# Altium project BiDirectional Charger - DC-DC.PrjPcb
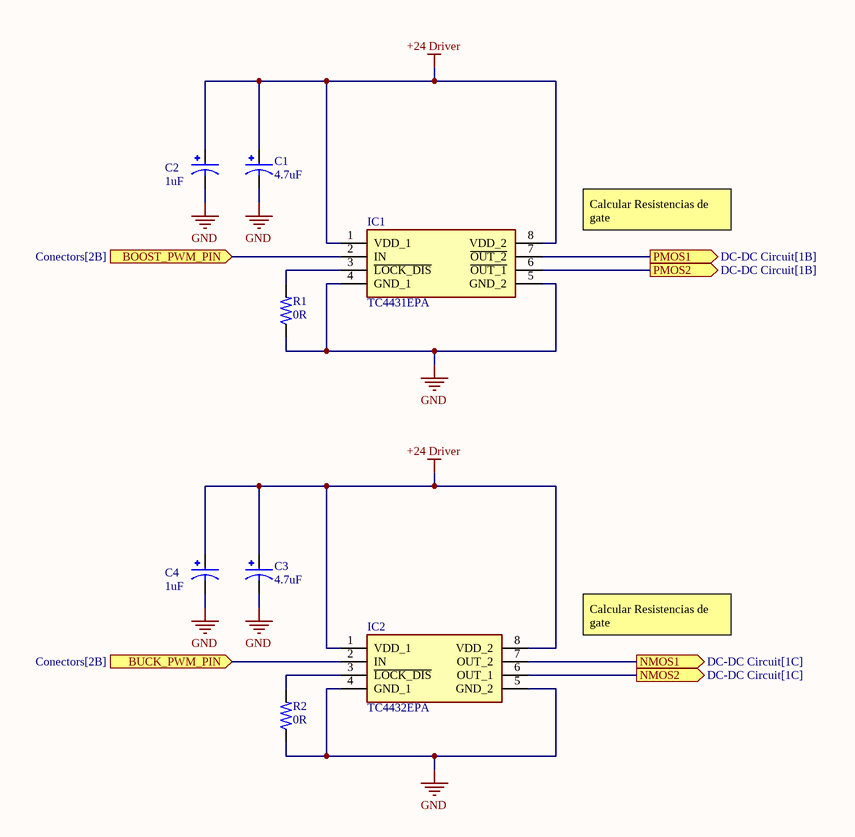
[diagram p0: Mosfet Driver.SchDoc]
3 sheets, 57 parts. Net scope: flat (ports and power ports of the same name join across sheets).
Board file: DC-DC PCB.PcbDoc
Sheets:
  Mosfet Driver.SchDoc
  DC-DC Circuit.SchDoc
  Conectors.SchDoc

## Sheet Mosfet Driver.SchDoc
size A4; SheetNumber: 1; SheetTotal: 2

### Parts
C1  4.7uF  [Electrolytic 4x5.4]
C2  1uF  [Electrolytic 4x5.4]
C3  4.7uF  [Electrolytic 4x5.4]
C4  1uF  [Electrolytic 4x5.4]
IC1  TC4431EPA  [DIP781W56P254L950H533Q8N]
IC2  TC4432EPA  [DIP781W56P254L950H533Q8N]
R1  0R  [0805]
R2  0R  [0805]

### Ports
BOOST_PWM_PIN (in, see Conectors[2B]), BUCK_PWM_PIN (in, see Conectors[2B]), NMOS1 (out, see DC-DC Circuit[1C]), NMOS2 (out, see DC-DC Circuit[1C]), PMOS1 (out, see DC-DC Circuit[1B]), PMOS2 (out, see DC-DC Circuit[1B])

### Nets
+24 Driver: C1.1 C2.1 C3.1 C4.1 IC1.1(VDD_1) IC1.8(VDD_2) IC2.1(VDD_1) IC2.8(VDD_2)
GND: C1.2 C2.2 C3.2 C4.2 IC1.4(GND_1) IC1.5(GND_2) IC2.4(GND_1) IC2.5(GND_2) R1.1 R2.1
NetIC1_2: IC1.2(IN) ; port BOOST_PWM_PIN
NetIC1_3: IC1.3(~{LOCK_DIS}) R1.2
NetIC1_6: IC1.6(~{OUT_1}) ; port PMOS2
NetIC1_7: IC1.7(~{OUT_2}) ; port PMOS1
NetIC2_2: IC2.2(IN) ; port BUCK_PWM_PIN
NetIC2_3: IC2.3(~{LOCK_DIS}) R2.2
NetIC2_6: IC2.6(OUT_1) ; port NMOS2
NetIC2_7: IC2.7(OUT_2) ; port NMOS1

### Notes on the sheet
- Calcular Resistencias de gate

### Library data of the parts
C1-C4 = Electrolytic 4x5.4: MF: Panasonic; MP: EEE-HA1E100WR; Package: RADIAL-2 Panasonic; Check_prices: https://www.snapeda.com/parts/EEE-HA1E100WR/Panasonic/view-part/778519/?ref=eda; Value: *; Price: None; Purchase-URL: https://pricing.snapeda.com/search/part/EEE-HA1E100WR/?ref=eda; SnapEDA_Link: https://www.snapeda.com/parts/EEE-HA1E100WR/Panasonic/view-part/778519/?ref=snap; Availability: In Stock
IC1 = TC4431EPA: Integrated Circuit; Manufacturer_Name: Microchip; Datasheet Link: http://www.microchip.com/mymicrochip/filehandler.aspx?ddocname=en011707; Height: 5.334mm; Manufacturer_Part_Number: TC4431EPA; Mouser Part Number: 579-TC4431EPA; Mouser Price/Stock: https://www.mouser.co.uk/ProductDetail/Microchip-Technology/TC4431EPA?qs=6NittM2kKvToa0NDydYeNA%3D%3D; Arrow Part Number: TC4431EPA; Arrow Price/Stock: https://www.arrow.com/en/products/tc4431epa/microchip-technology
IC2 = TC4432EPA: Integrated Circuit; Manufacturer_Name: Microchip; Datasheet Link: http://ww1.microchip.com/downloads/en/DeviceDoc/21424d.pdf; Height: 5.334mm; Manufacturer_Part_Number: TC4432EPA; Mouser Part Number: 579-TC4432EPA; Mouser Price/Stock: https://www.mouser.co.uk/ProductDetail/Microchip-Technology-Atmel/TC4432EPA?qs=EkZBwCRGcSv79fL5L3lP6g%3D%3D; Arrow Part Number: TC4432EPA; Arrow Price/Stock: https://www.arrow.com/en/products/tc4432epa/microchip-technology
R1 R2 = 0805_Resistor: Power_Rating: .25 W; MP: 2-2176053-0; Tolerance: 1%; Resistance: .33; MF: TE Connectivity; Price: None; Availability: In Stock; EU_RoHS_Compliance: Compliant with Exemptions; Package: 0805; Value: *; SnapEDA_Link: https://www.snapeda.com/parts/2-2176053-0/TE+Connectivity/view-part/?ref=snap; Check_prices: https://www.snapeda.com/parts/2-2176053-0/TE+Connectivity/view-part/?ref=eda

## Sheet DC-DC Circuit.SchDoc
size A4; SheetNumber: 2; SheetTotal: 3
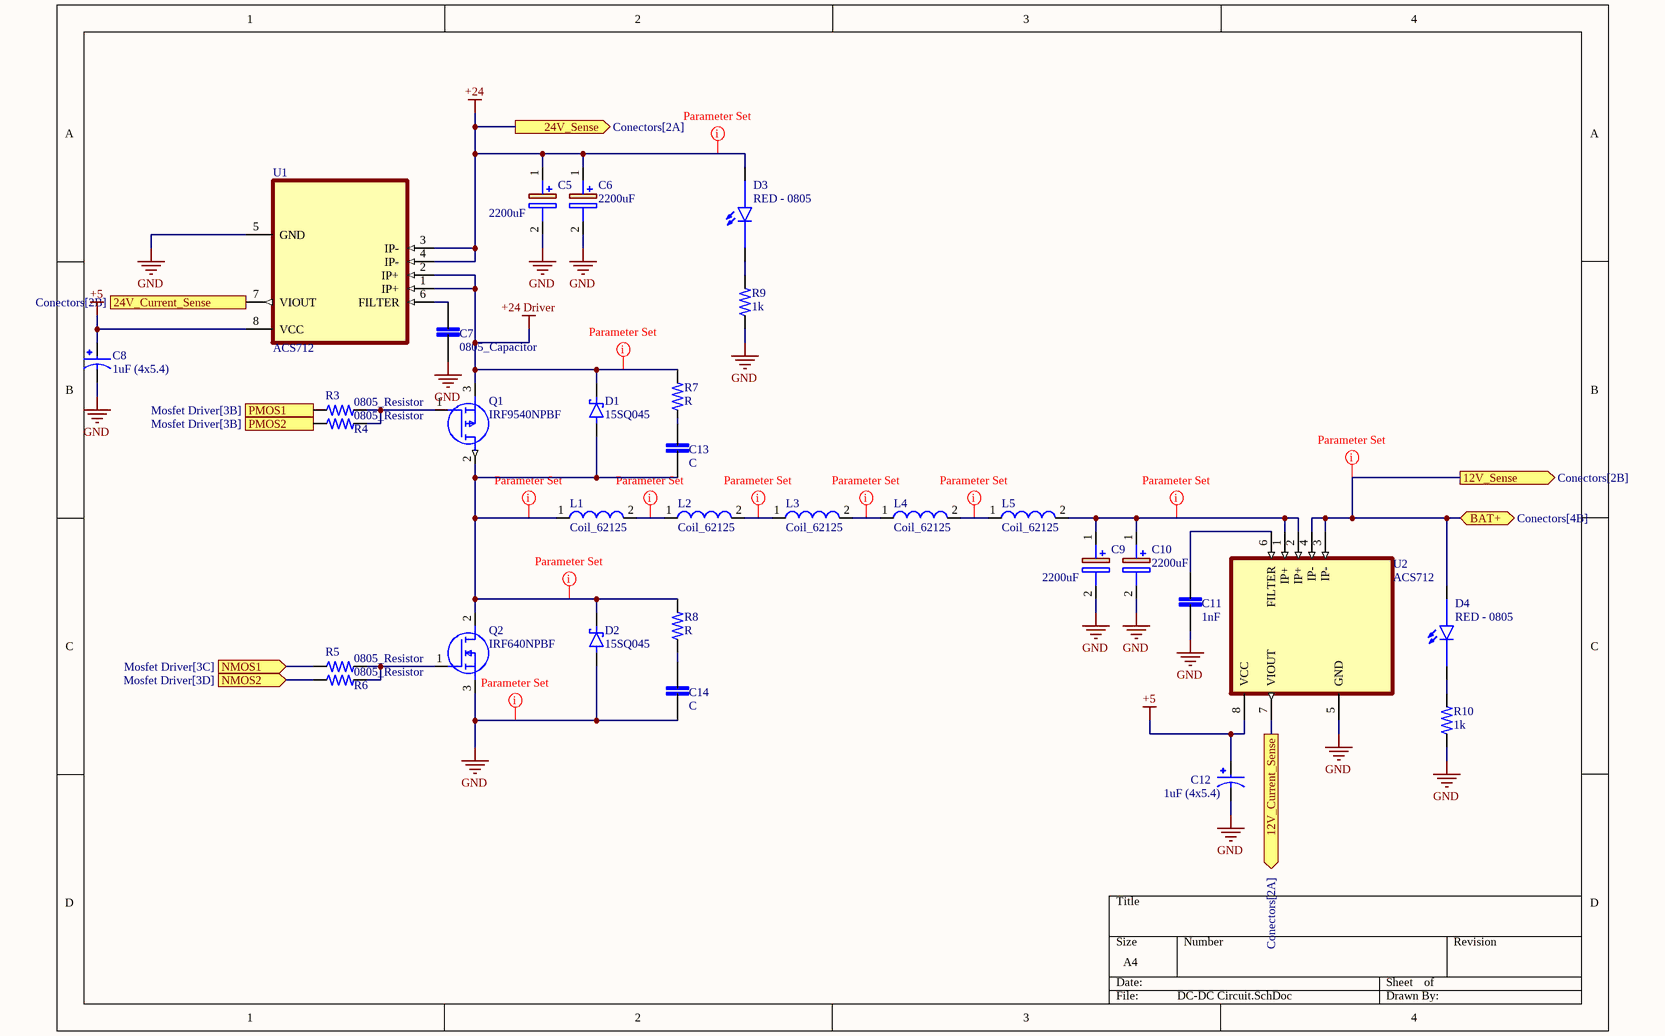
[diagram p1: DC-DC Circuit.SchDoc]

### Parts
C5  2200uF  [CAPPRD500W62D1300H2150]
C6  2200uF  [CAPPRD500W62D1300H2150]
C7  0805_Capacitor  [0805]
C8  1uF (4x5.4)  [Electrolytic 4x5.4]
C9  2200uF  [CAPPRD500W62D1300H2150]
C10  2200uF  [CAPPRD500W62D1300H2150]
C11  1nF  [0805]
C12  1uF (4x5.4)  [Electrolytic 4x5.4]
C13  C  [0805]
C14  C  [0805]
D1  15SQ045  [Common Trhough Hole]
D2  15SQ045  [Common Trhough Hole]
D3  RED - 0805  [LED 0805]
D4  RED - 0805  [LED 0805]
L1  Coil_62125  [Coil 65125]
L2  Coil_62125  [Coil 65125]
L3  Coil_62125  [Coil 65125]
L4  Coil_62125  [Coil 65125]
L5  Coil_62125  [Coil 65125]
Q1  IRF9540NPBF  [TO254P469X1042X1967-3P]
Q2  IRF640NPBF  [TO254P483X1016X1994-3P]
R3  0805_Resistor  [0805]
R4  0805_Resistor  [0805]
R5  0805_Resistor  [0805]
R6  0805_Resistor  [0805]
R7  R  [0805]
R8  R  [0805]
R9  1k  [0805]
R10  1k  [0805]
U1  ACS712  [ACS712]
U2  ACS712  [ACS712]

### Ports
12V_Current_Sense (out, see Conectors[2A]), 12V_Sense (out, see Conectors[2B]), 24V_Current_Sense (out, see Conectors[2B]), 24V_Sense (out, see Conectors[2A]), BAT+ (bidir, see Conectors[4B]), NMOS1 (in, see Mosfet Driver[3C]), NMOS2 (in, see Mosfet Driver[3D]), PMOS1 (in, see Mosfet Driver[3B]), PMOS2 (in, see Mosfet Driver[3B])

### Nets
+5: C8.1 C12.1 U1.8(VCC) U2.8(VCC)
+24: C5.1(+) C6.1(+) D3.A U1.3(IP-) U1.4(IP-) ; port 24V_Sense
+24 Driver: D1.1(K) Q1.3(S) R7.2 U1.1(IP+) U1.2(IP+)
GND: C5.2(-) C6.2(-) C7.1 C8.2 C9.2(-) C10.2(-) C11.1 C12.2 C14.2 D2.2(A) Q2.3(S) R9.1 R10.1 U1.5(GND) U2.5(GND)
Net#1_1: D4.A U2.3(IP-) U2.4(IP-) ; port BAT+, port 12V_Sense
NetC7_2: C7.2 U1.6(FILTER)
NetC9_1: C9.1(+) C10.1(+) L5.2 U2.1(IP+) U2.2(IP+)
NetC11_2: C11.2 U2.6(FILTER)
NetC13_1: C13.1 R7.1
NetC13_2: C13.2 D1.2(A) D2.1(K) L1.1 Q1.2(D) Q2.2(D) R8.2
NetC14_1: C14.1 R8.1
NetD3_C: D3.C R9.2
NetD4_C: D4.C R10.2
NetIC1_6: R4.1 ; port PMOS2
NetIC1_7: R3.1 ; port PMOS1
NetIC2_6: R6.1 ; port NMOS2
NetIC2_7: R5.1 ; port NMOS1
NetJ1_2: U2.7(VIOUT) ; port 12V_Current_Sense
NetJ1_3: U1.7(VIOUT) ; port 24V_Current_Sense
NetL1_2: L1.2 L2.1
NetL2_2: L2.2 L3.1
NetL3_2: L3.2 L4.1
NetL4_2: L4.2 L5.1
NetQ1_1: Q1.1(G) R3.2 R4.2
NetQ2_1: Q2.1(G) R5.2 R6.2

### Layout directives
net class DirectPour: +24, +24 Driver, GND, Net#1_1, NetC9_1, NetC13_2, NetL1_2, NetL2_2, NetL3_2, NetL4_2

### Library data of the parts
C5 C6 C9 C10 = 860020578018: Capacitor Polarised; Manufacturer_Name: Wurth Elektronik; Datasheet Link: https://ms.componentsearchengine.com/Datasheets/2/860020578018.pdf; Height: 21.5mm; Manufacturer_Part_Number: 860020578018; Mouser Part Number: 710-860020578018; Mouser Price/Stock: https://www.mouser.co.uk/ProductDetail/Wurth-Elektronik/860020578018?qs=0KOYDY2FL28EAkbJaifUfg%3D%3D
C7 C11 C13 C14 = 0805_Capacitor: MP: LD051A121KAB2A; MF: AVX; SnapEDA_Link: https://www.snapeda.com/parts/LD051A121KAB2A/AVX/view-part/?ref=snap; Package: 0805 AVX; Check_prices: https://www.snapeda.com/parts/LD051A121KAB2A/AVX/view-part/?ref=eda; Purchase-URL: https://pricing.snapeda.com/search/part/LD051A121KAB2A/?ref=eda; Price: None; Value: *; Availability: In Stock
C8 C12 = Electrolytic 4x5.4: MF: Panasonic; MP: EEE-HA1E100WR; Package: RADIAL-2 Panasonic; Check_prices: https://www.snapeda.com/parts/EEE-HA1E100WR/Panasonic/view-part/778519/?ref=eda; Value: *; Price: None; Purchase-URL: https://pricing.snapeda.com/search/part/EEE-HA1E100WR/?ref=eda; SnapEDA_Link: https://www.snapeda.com/parts/EEE-HA1E100WR/Panasonic/view-part/778519/?ref=snap; Availability: In Stock
D1 D2 = Schottky Diode: MF: Diodes Inc.; MP: 1N5817-T; Package: DO-41 Diodes Inc.; Price: None; Check_prices: https://www.snapeda.com/parts/1N5817-T/Diodes+Inc./view-part/?ref=eda; Value: *; SnapEDA_Link: https://www.snapeda.com/parts/1N5817-T/Diodes+Inc./view-part/?ref=snap; Availability: In Stock; Purchase-URL: https://pricing.snapeda.com/search/part/1N5817-T/?ref=eda
D3 D4 = LED 0805: LED Uni-Color Green 4-Pin Chip 0805 T/R; MP: 597-3305-607F; Availability: Unavailable; Value: *; Price: None; Package: None
L1-L5 = Coil_62125: Inductor Power Wirewound 470uH 10% 1KHz 25Q-Factor Ferrite 210mA 3.3Ohm DCR T/R; MF: Bourns; MP: SDR0604-471KL; Digi-Key_Part_Number: SDR0604-471KLCT-ND; Package: Nonstandard Bourns; Value: *; SnapEDA_Link: https://www.snapeda.com/parts/SDR0604-471KL/Bourns/view-part/567387/?ref=snap; Digi-Key_Purchase_URL: https://www.digikey.com/product-detail/en/bourns-inc/SDR0604-471KL/SDR0604-471KLCT-ND/2352941?utm_source=snapeda&utm_medium=aggregator&utm_campaign=symbol
Q1 = IRF9540NPBF: MOSFET (P-Channel); Manufacturer_Name: Infineon; Datasheet Link: https://www.infineon.com/dgdl/irf9540npbf.pdf?fileId=5546d462533600a401535611cfa21dc8; Height: 4.69mm; Manufacturer_Part_Number: IRF9540NPBF; Mouser Part Number: 942-IRF9540NPBF; Mouser Price/Stock: https://www.mouser.co.uk/ProductDetail/Infineon-Technologies/IRF9540NPBF?qs=9%252BKlkBgLFf0vnuA8mxUPtw%3D%3D; Arrow Part Number: IRF9540NPBF; Arrow Price/Stock: https://www.arrow.com/en/products/irf9540npbf/infineon-technologies-ag?region=europe
Q2 = IRF640NPBF: MOSFET (N-Channel); Manufacturer_Name: Infineon; Datasheet Link: https://www.infineon.com/dgdl/Infineon-IRF640N-DataSheet-v01_01-EN.pdf?fileId=5546d462533600a4015355e7be9019ee; Height: 4.83mm; Manufacturer_Part_Number: IRF640NPBF; Mouser Part Number: 942-IRF640NPBF; Mouser Price/Stock: https://www.mouser.co.uk/ProductDetail/Infineon-Technologies/IRF640NPBF?qs=9%252BKlkBgLFf3E8kFH1ru13w%3D%3D; Arrow Part Number: IRF640NPBF; Arrow Price/Stock: https://www.arrow.com/en/products/irf640npbf/infineon-technologies-ag?region=europe
R3-R10 = 0805_Resistor: as R1 on sheet Mosfet Driver; Price: None; Availability: In Stock; EU_RoHS_Compliance: Compliant with Exemptions; Package: 0805; Value: *; SnapEDA_Link: https://www.snapeda.com/parts/2-2176053-0/TE+Connectivity/view-part/?ref=snap; Check_prices: https://www.snapeda.com/parts/2-2176053-0/TE+Connectivity/view-part/?ref=eda
U1 U2 = ACS712: Current Sensor 5A 1 Channel Hall Effect, Open Loop Bidirectional 8-SOIC (0.154, 3.90mm Width); MP: ACS712ELCTR-05B-T; MF: Allegro MicroSystems LLC; SnapEDA_Link: https://www.snapeda.com/parts/ACS712ELCTR-05B-T/Allegro+MicroSystems+LLC/view-part/?ref=snap; Package: SOIC-8 Allegro MicroSystems LLC; Check_prices: https://www.snapeda.com/parts/ACS712ELCTR-05B-T/Allegro+MicroSystems+LLC/view-part/?ref=eda; Purchase-URL: https://pricing.snapeda.com/search/part/ACS712ELCTR-05B-T/?ref=eda; Price: None; Value: *; Availability: In Stock

## Sheet Conectors.SchDoc
size A4; SheetNumber: 3; SheetTotal: 3
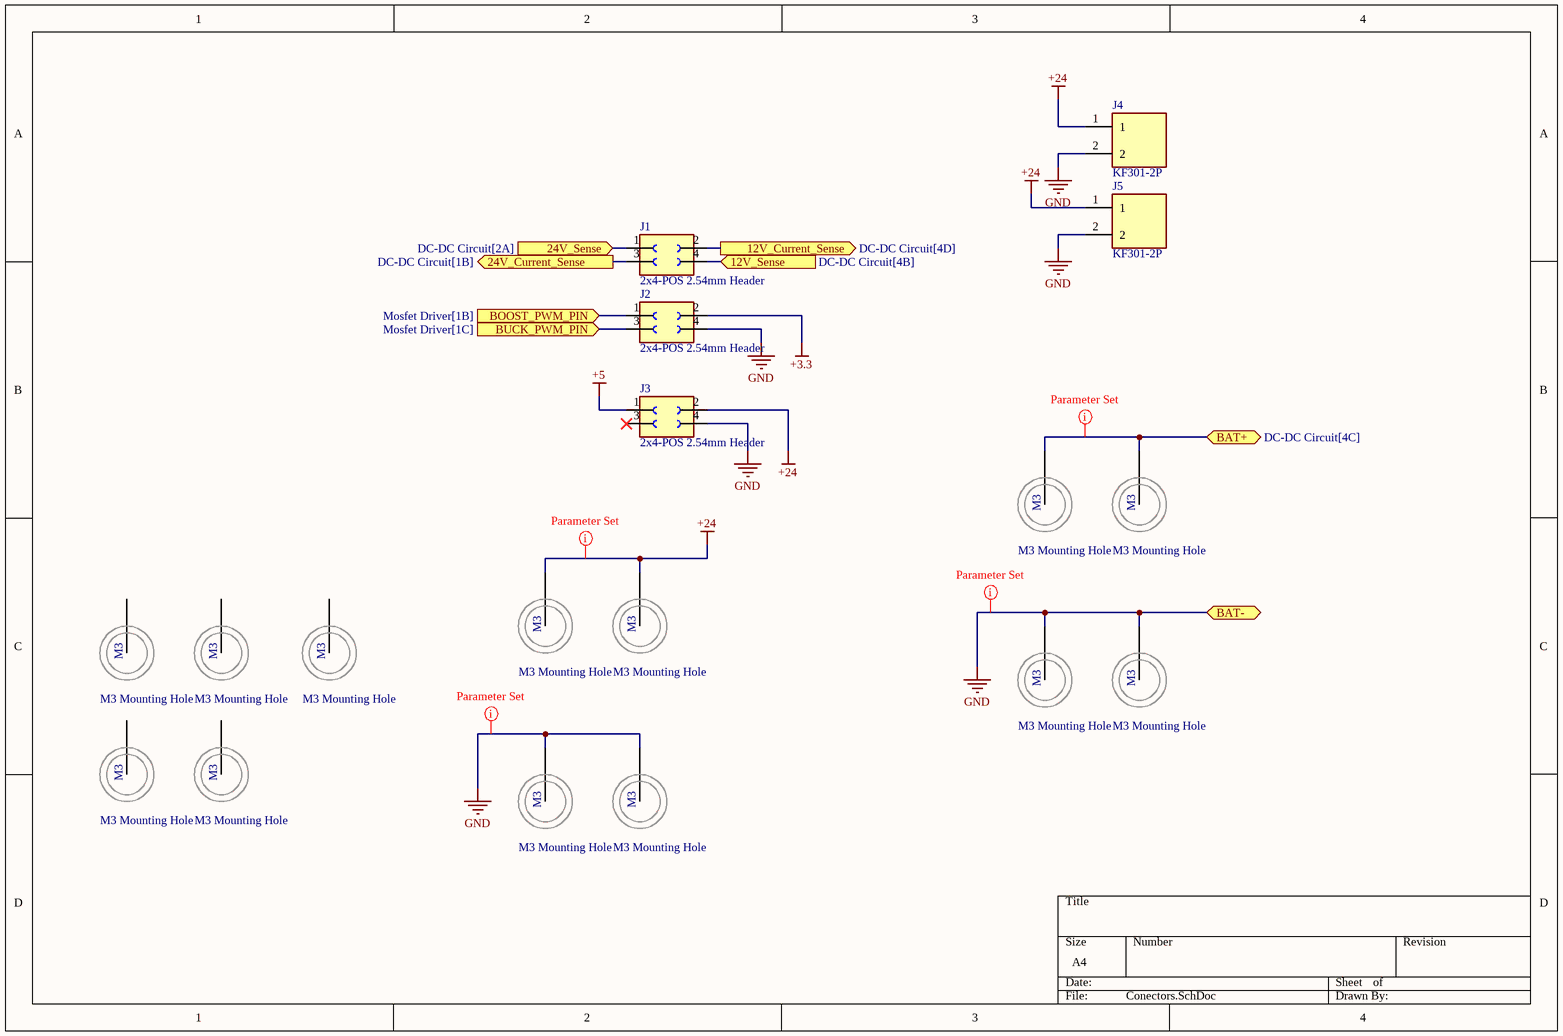
[diagram p2: Conectors.SchDoc]

### Parts
(Parts that share a designator on the sheet are numbered #1, #2 ... from top to bottom, then left to right.)
#1  M3 Mounting Hole  [M3 - Mounting Hole]
#2  M3 Mounting Hole  [M3 - Mounting Hole]
#3  M3 Mounting Hole  [M3 - Mounting Hole]
#4  M3 Mounting Hole  [M3 - Mounting Hole]
#5  M3 Mounting Hole  [M3 - Mounting Hole]
#6  M3 Mounting Hole  [M3 - Mounting Hole]
#7  M3 Mounting Hole  [M3 - Mounting Hole]
#8  M3 Mounting Hole  [M3 - Mounting Hole]
#9  M3 Mounting Hole  [M3 - Mounting Hole]
#10  M3 Mounting Hole  [M3 - Mounting Hole]
#11  M3 Mounting Hole  [M3 - Mounting Hole]
#12  M3 Mounting Hole  [M3 - Mounting Hole]
#13  M3 Mounting Hole  [M3 - Mounting Hole]
J1  2x4-POS 2.54mm Header  [2x4-POS 2.54mm Female Header]
J2  2x4-POS 2.54mm Header  [2x4-POS 2.54mm Female Header]
J3  2x4-POS 2.54mm Header  [2x4-POS 2.54mm Female Header]
J4  KF301-2P  [KF301-2P]
J5  KF301-2P  [KF301-2P]

### Ports
12V_Current_Sense (out, see DC-DC Circuit[4D]), 12V_Sense (in, see DC-DC Circuit[4B]), 24V_Current_Sense (out, see DC-DC Circuit[1B]), 24V_Sense (in, see DC-DC Circuit[2A]), BAT+ (bidir, see DC-DC Circuit[4C]), BAT- (bidir), BOOST_PWM_PIN (in, see Mosfet Driver[1B]), BUCK_PWM_PIN (in, see Mosfet Driver[1C])

### Nets
+3.3: J2.2
+5: J3.1
+24: #3.1(M3) #4.1(M3) J1.1 J3.2 J4.1 J5.1 ; port 24V_Sense
GND: #8.1(M3) #9.1(M3) #12.1(M3) #13.1(M3) J2.4 J3.4 J4.2 J5.2 ; port BAT-
Net#1_1: #1.1(M3) #2.1(M3) J1.4 ; port 12V_Sense, port BAT+
NetIC1_2: J2.1 ; port BOOST_PWM_PIN
NetIC2_2: J2.3 ; port BUCK_PWM_PIN
NetJ1_2: J1.2 ; port 12V_Current_Sense
NetJ1_3: J1.3 ; port 24V_Current_Sense

Not connected (* = marked no-connect by the designer): #5 1(M3); #6 1(M3); #7 1(M3); #10 1(M3); #11 1(M3); J3 3(2)*

### Layout directives
net class DirectPour: +24, GND, Net#1_1

### Library data of the parts
J1-J3 = 2x4-POS 2.54mm Header: Female header [WÃ¼rth Elektronik] 613004243121 Female header; SnapEDA_Link: https://www.snapeda.com/parts/613004243121/W%C3%BCrth%20Elektronik/view-part/1737074/?ref=snap; Check_prices: https://www.snapeda.com/parts/613004243121/W%C3%BCrth%20Elektronik/view-part/1737074/?ref=eda; Availability: Unavailable; Value: *; MF: WÃ¼rth Elektronik; Price: None; MP: 613004243121; Package: None
J4 J5 = KF301-2P: 2 Pin Terminal Block 5mm Pitch; Price: None; Value: *; MP: KF301-2P; Package: None; Availability: Unavailable

## Nets that join several sheets
+5: DC-DC Circuit (C8.1 C12.1 U1.8 U2.8), Conectors (J3.1)
+24: DC-DC Circuit (5 pins), Conectors (6 pins)
+24 Driver: Mosfet Driver (8 pins), DC-DC Circuit (5 pins)
GND: Mosfet Driver (10 pins), DC-DC Circuit (15 pins), Conectors (8 pins)
Net#1_1: DC-DC Circuit (D4.A U2.3 U2.4), Conectors (#1.1 #2.1 J1.4)
NetIC1_2: Mosfet Driver (IC1.2), Conectors (J2.1)
NetIC1_6: Mosfet Driver (IC1.6), DC-DC Circuit (R4.1)
NetIC1_7: Mosfet Driver (IC1.7), DC-DC Circuit (R3.1)
NetIC2_2: Mosfet Driver (IC2.2), Conectors (J2.3)
NetIC2_6: Mosfet Driver (IC2.6), DC-DC Circuit (R6.1)
NetIC2_7: Mosfet Driver (IC2.7), DC-DC Circuit (R5.1)
NetJ1_2: DC-DC Circuit (U2.7), Conectors (J1.2)
NetJ1_3: DC-DC Circuit (U1.7), Conectors (J1.3)